# EAGLE design 5940 (EAGLE 7.4.0)
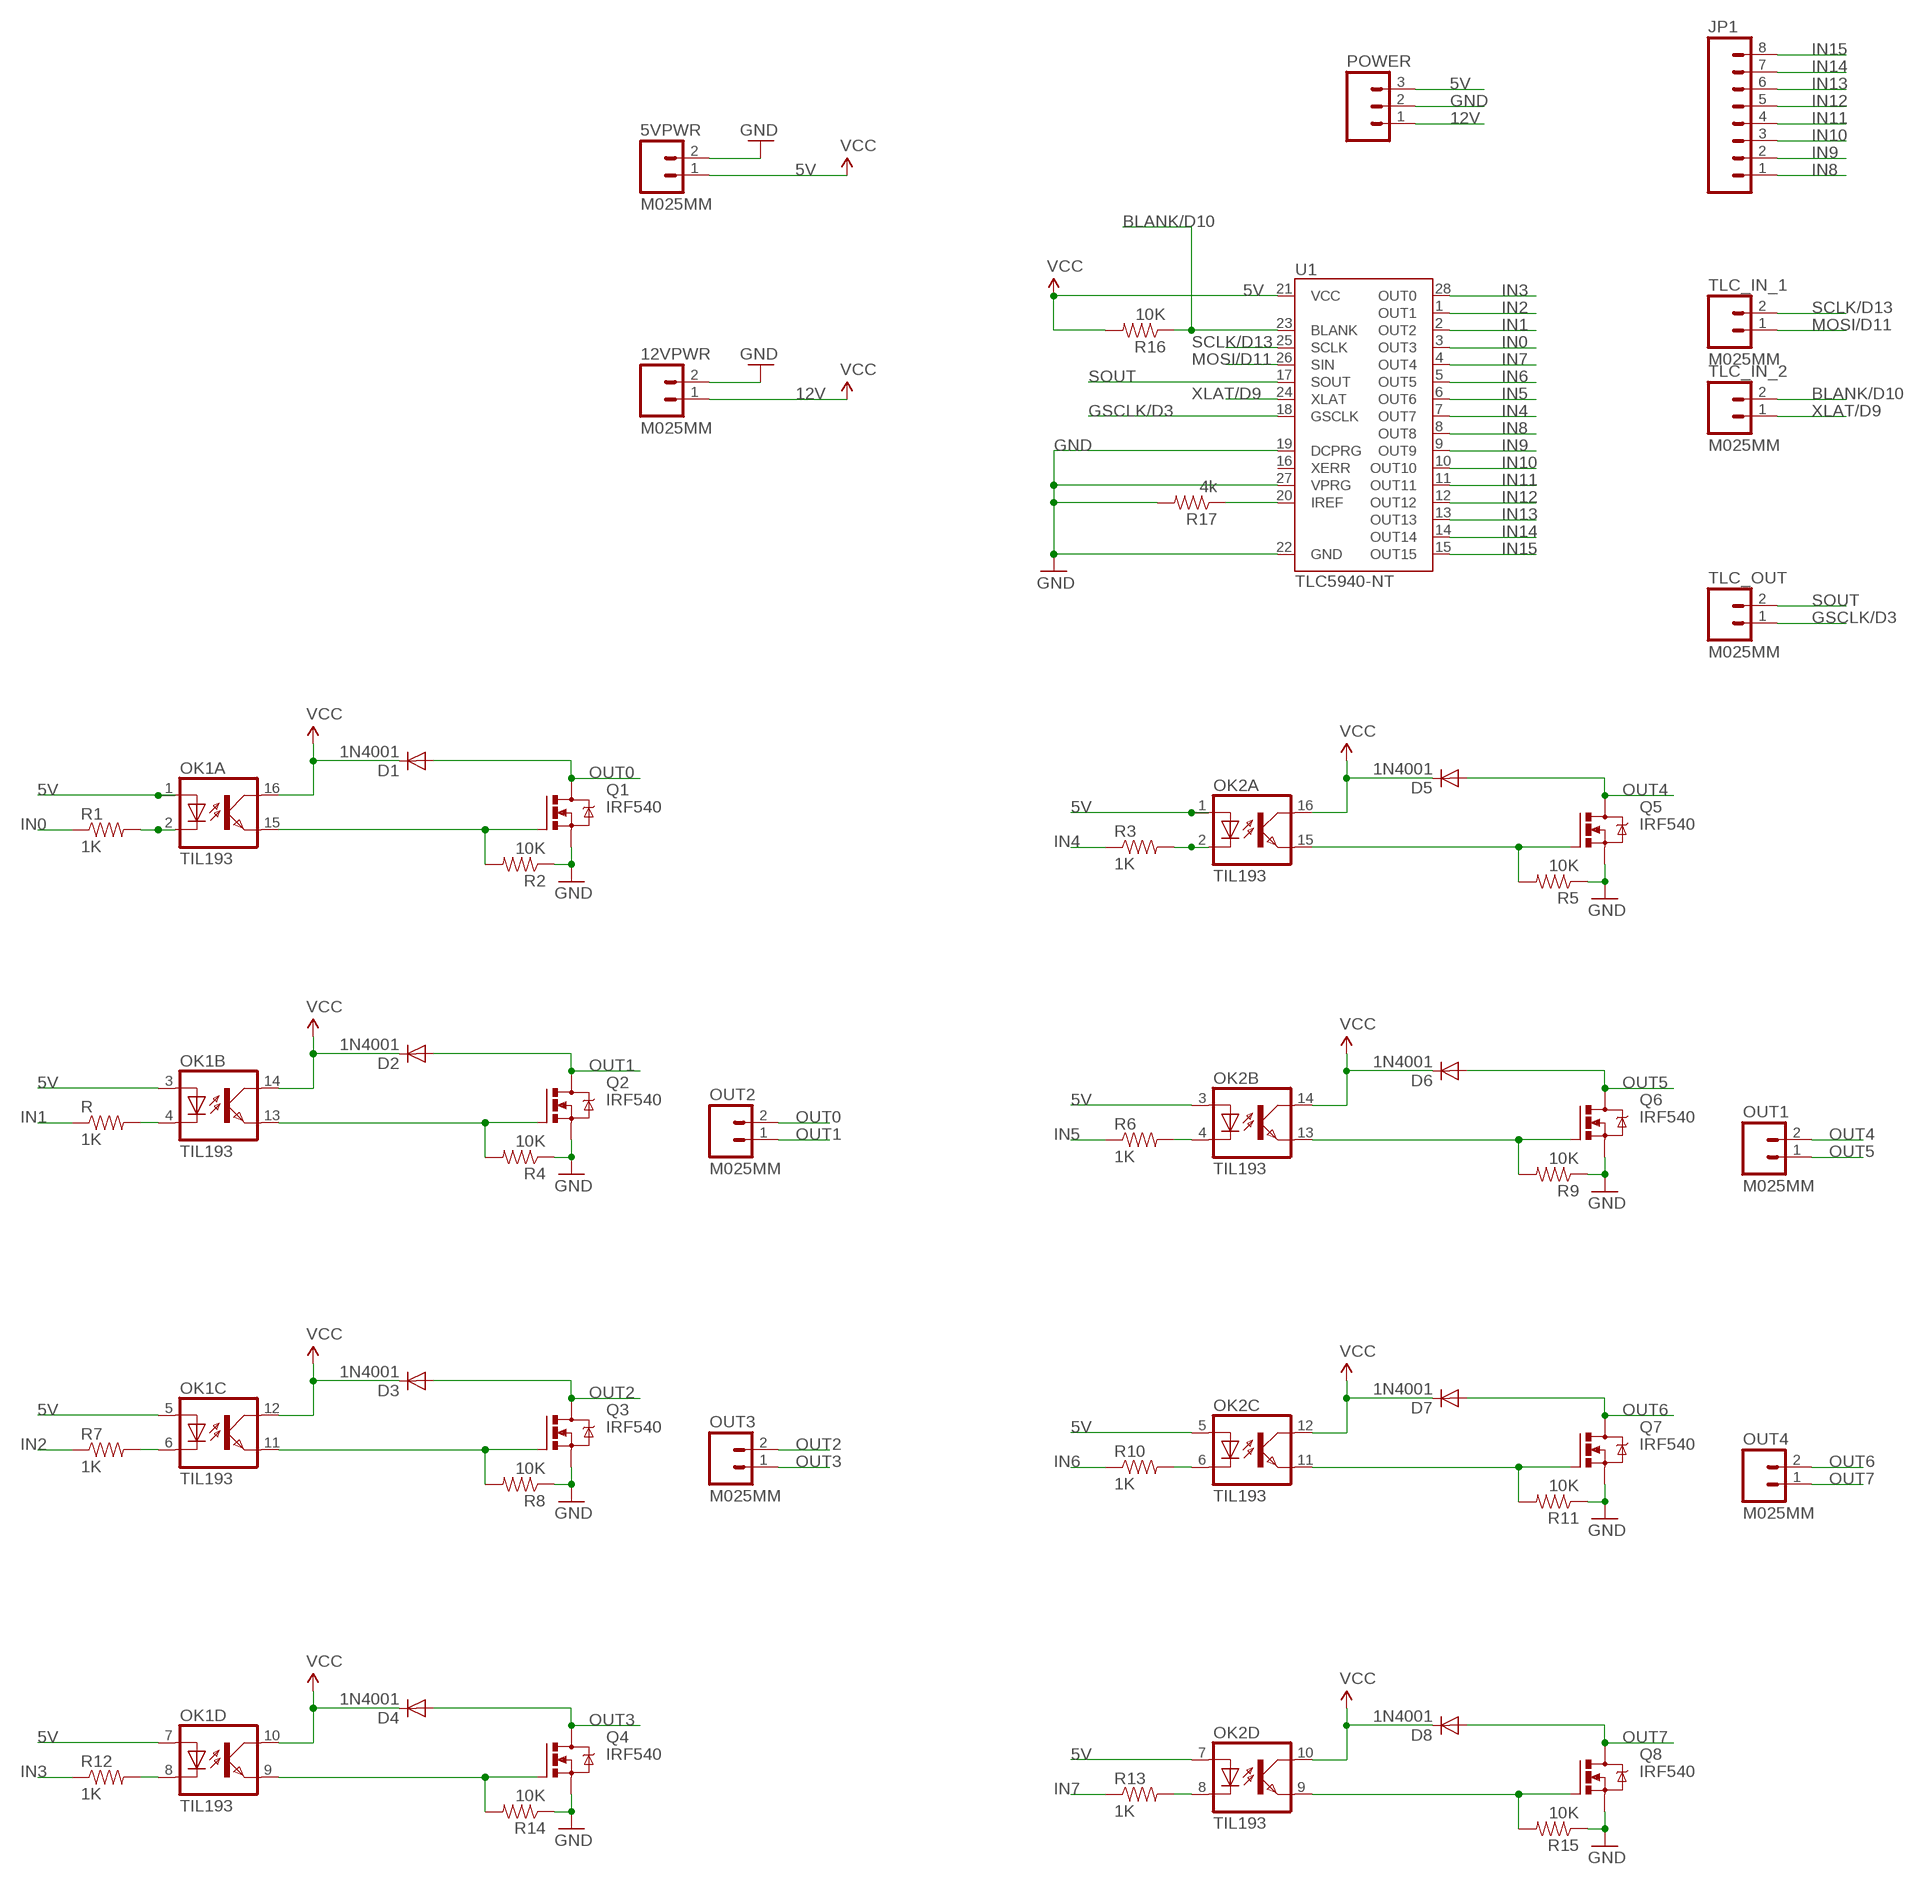
[diagram p0: schematic, sheet 1]

## Parts
5VPWR  M025MM  [SCREWTERMINAL-5MM-2]
12VPWR  M025MM  [SCREWTERMINAL-5MM-2]
D1  1N4001  DIODEPTH  [DIODE-1N4001]
D2  1N4001  DIODEPTH  [DIODE-1N4001]
D3  1N4001  DIODEPTH  [DIODE-1N4001]
D4  1N4001  DIODEPTH  [DIODE-1N4001]
D5  1N4001  DIODEPTH  [DIODE-1N4001]
D6  1N4001  DIODEPTH  [DIODE-1N4001]
D7  1N4001  DIODEPTH  [DIODE-1N4001]
D8  1N4001  DIODEPTH  [DIODE-1N4001]
JP1  M08  [1X08_ROUND]
OK1  TIL193  [DIL16]
OK2  TIL193  [DIL16]
OUT1  M025MM  [SCREWTERMINAL-5MM-2]
OUT2  M025MM  [SCREWTERMINAL-5MM-2]
OUT3  M025MM  [SCREWTERMINAL-5MM-2]
OUT4  M025MM  [SCREWTERMINAL-5MM-2]
POWER  M03LONGPADS  [1X03_LONGPADS]
Q1  IRF540  [TO220BV]
Q2  IRF540  [TO220BV]
Q3  IRF540  [TO220BV]
Q4  IRF540  [TO220BV]
Q5  IRF540  [TO220BV]
Q6  IRF540  [TO220BV]
Q7  IRF540  [TO220BV]
Q8  IRF540  [TO220BV]
R  1K  RESISTORPTH-1/4W  [AXIAL-0.4]
R1  1K  RESISTORPTH-1/4W  [AXIAL-0.4]
R2  10K  RESISTORPTH-1/4W  [AXIAL-0.4]
R3  1K  RESISTORPTH-1/4W  [AXIAL-0.4]
R4  10K  RESISTORPTH-1/4W  [AXIAL-0.4]
R5  10K  RESISTORPTH-1/4W  [AXIAL-0.4]
R6  1K  RESISTORPTH-1/4W  [AXIAL-0.4]
R7  1K  RESISTORPTH-1/4W  [AXIAL-0.4]
R8  10K  RESISTORPTH-1/4W  [AXIAL-0.4]
R9  10K  RESISTORPTH-1/4W  [AXIAL-0.4]
R10  1K  RESISTORPTH-1/4W  [AXIAL-0.4]
R11  10K  RESISTORPTH-1/4W  [AXIAL-0.4]
R12  1K  RESISTORPTH-1/4W  [AXIAL-0.4]
R13  1K  RESISTORPTH-1/4W  [AXIAL-0.4]
R14  10K  RESISTORPTH-1/4W  [AXIAL-0.4]
R15  10K  RESISTORPTH-1/4W  [AXIAL-0.4]
R16  10K  RESISTORPTH-1/4W  [AXIAL-0.4]
R17  4k  RESISTORPTH-1/4W  [AXIAL-0.4]
TLC_IN_1  M025MM  [SCREWTERMINAL-5MM-2]
TLC_IN_2  M025MM  [SCREWTERMINAL-5MM-2]
TLC_OUT  M025MM  [SCREWTERMINAL-5MM-2]
U1  TLC5940-NT  [DIL28-3]

## Nets
5V: 5VPWR.1 OK1.1(A:A) OK1.3(B:A) OK1.5(C:A) OK1.7(D:A) OK2.1(A:A) OK2.3(B:A) OK2.5(C:A) OK2.7(D:A) POWER.3 R16.P$2 U1.21(VCC) ; supply symbol labelled VCC
12V: 12VPWR.1 D1.C D2.C D3.C D4.C D5.C D6.C D7.C D8.C OK1.10(D:COL) OK1.12(C:COL) OK1.14(B:COL) OK1.16(A:COL) OK2.10(D:COL) OK2.12(C:COL) OK2.14(B:COL) OK2.16(A:COL) POWER.1 ; supply symbol labelled VCC
BLANK/D10: R16.P$1 TLC_IN_2.2 U1.23(BLANK)
GND: 5VPWR.2 12VPWR.2 POWER.2 Q1.S Q2.S Q3.S Q4.S Q5.S Q6.S Q7.S Q8.S R2.P$1 R4.P$1 R5.P$1 R8.P$1 R9.P$1 R11.P$1 R14.P$1 R15.P$1 R17.P$2 U1.19(DCPRG) U1.22(GND) U1.27(VPRG)
GSCLK/D3: TLC_OUT.1 U1.18(GSCLK)
IN0: R1.P$1 U1.3(OUT3)
IN1: R.P$1 U1.2(OUT2)
IN2: R7.P$1 U1.1(OUT1)
IN3: R12.P$1 U1.28(OUT0)
IN4: R3.P$1 U1.7(OUT7)
IN5: R6.P$1 U1.6(OUT6)
IN6: R10.P$1 U1.5(OUT5)
IN7: R13.P$1 U1.4(OUT4)
IN8: JP1.1 U1.8(OUT8)
IN9: JP1.2 U1.9(OUT9)
IN10: JP1.3 U1.10(OUT10)
IN11: JP1.4 U1.11(OUT11)
IN12: JP1.5 U1.12(OUT12)
IN13: JP1.6 U1.13(OUT13)
IN14: JP1.7 U1.14(OUT14)
IN15: JP1.8 U1.15(OUT15)
MOSI/D11: TLC_IN_1.1 U1.26(SIN)
N$1: OK2.2(A:C) R3.P$2
N$2: OK1.4(B:C) R.P$2
N$3: OK2.15(A:EMIT) Q5.G R5.P$2
N$4: OK1.15(A:EMIT) Q1.G R2.P$2
N$5: OK1.13(B:EMIT) Q2.G R4.P$2
N$6: OK1.2(A:C) R1.P$2
N$7: OK2.13(B:EMIT) Q6.G R9.P$2
N$8: OK2.4(B:C) R6.P$2
N$9: OK1.11(C:EMIT) Q3.G R8.P$2
N$10: OK2.11(C:EMIT) Q7.G R11.P$2
N$11: OK1.6(C:C) R7.P$2
N$12: OK2.6(C:C) R10.P$2
N$13: OK1.9(D:EMIT) Q4.G R14.P$2
N$14: OK2.9(D:EMIT) Q8.G R15.P$2
N$15: OK1.8(D:C) R12.P$2
N$16: OK2.8(D:C) R13.P$2
N$26: R17.P$1 U1.20(IREF)
OUT0: D1.A OUT2.2 Q1.D
OUT1: D2.A OUT2.1 Q2.D
OUT2: D3.A OUT3.2 Q3.D
OUT3: D4.A OUT3.1 Q4.D
OUT4: D5.A OUT1.2 Q5.D
OUT5: D6.A OUT1.1 Q6.D
OUT6: D7.A OUT4.2 Q7.D
OUT7: D8.A OUT4.1 Q8.D
SCLK/D13: TLC_IN_1.2 U1.25(SCLK)
SOUT: TLC_OUT.2 U1.17(SOUT)
XLAT/D9: TLC_IN_2.1 U1.24(XLAT)
Unconnected: U1.16(XERR)

## Library data of the parts
5VPWR 12VPWR OUT1-OUT4 TLC_IN_1 TLC_IN_2 TLC_OUT = SparkFun-Connectors:M02: Standard 2-pin 0.1" header. Use with - straight break away headers ( PRT-00116) - right angle break away headers (PRT-00553) - swiss pins (PRT-00743) - machine pins (PRT-00117) - female headers (PRT-00115) Molex polarized connector foot print use with: PRT-08233 with associated crimp pins and housings. 2.54_SCREWTERM for use with PRT-10571. 3.5mm Screw Terminal footprints for PRT-08084 5mm Screw Terminal footprints for use with PRT-08433
D1-D8 = SparkFun-DiscreteSemi:DIODE: Diode These are standard reverse protection diodes and small signal diodes. SMA package can handle up to about 1A. SOD-323 can handle about 200mA. What the SOD-323 package when ordering, there are some mfgs out there that are 5-pin packages.
JP1 = SparkFun-Connectors:M08: Header 8 Standard 8-pin 0.1" header. Use with straight break away headers (SKU : PRT-00116), right angle break away headers (PRT-00553), swiss pins (PRT-00743), machine pins (PRT-00117), and female headers (PRT-00115).
OK1 OK2 = optocoupler:TIL193: TEXAS INSTRUMENTS OPTO COUPLER; OC_FARNELL: 1683365; OC_NEWARK: unknown
POWER = SparkFun-Connectors:M03: Header 3 Standard 3-pin 0.1" header. Use with straight break away headers (SKU : PRT-00116), right angle break away headers (PRT-00553), swiss pins (PRT-00743), machine pins (PRT-00117), and female headers (PRT-00115). Molex polarized connector foot print use with SKU : PRT-08232 with associated crimp pins and housings.
Q1-Q8 = transistor-power:IRF540: HEXFET Power MOSFET
R R1-R17 = SparkFun-Resistors:RESISTOR: Resistor Basic schematic elements and footprints for 0603, 1206, and PTH resistors.
U1 = SparkFun-DigitalIC:TLC5940: 16-channel LED Driver with Dot Correction and Grayscale PWM Control The TLC5940 is a 16-channel, constant-current sink LED driver. Each channel has an individually adjustable 4096-step grayscale PWM brightness control and a 64-step, constant-current sink (dot correction). The dot correction adjusts the brightness variations between LED channels and other LED drivers. The dot correction data is stored in an integrated EEPROM. Both grayscale control and dot correction are accessible via a serial interface. A single external resistor sets the maximum current value of all 16 channels. Packages: 28-pin HTSSOP 32-pin 5x5mm QFN 28-pin DIP

## Board
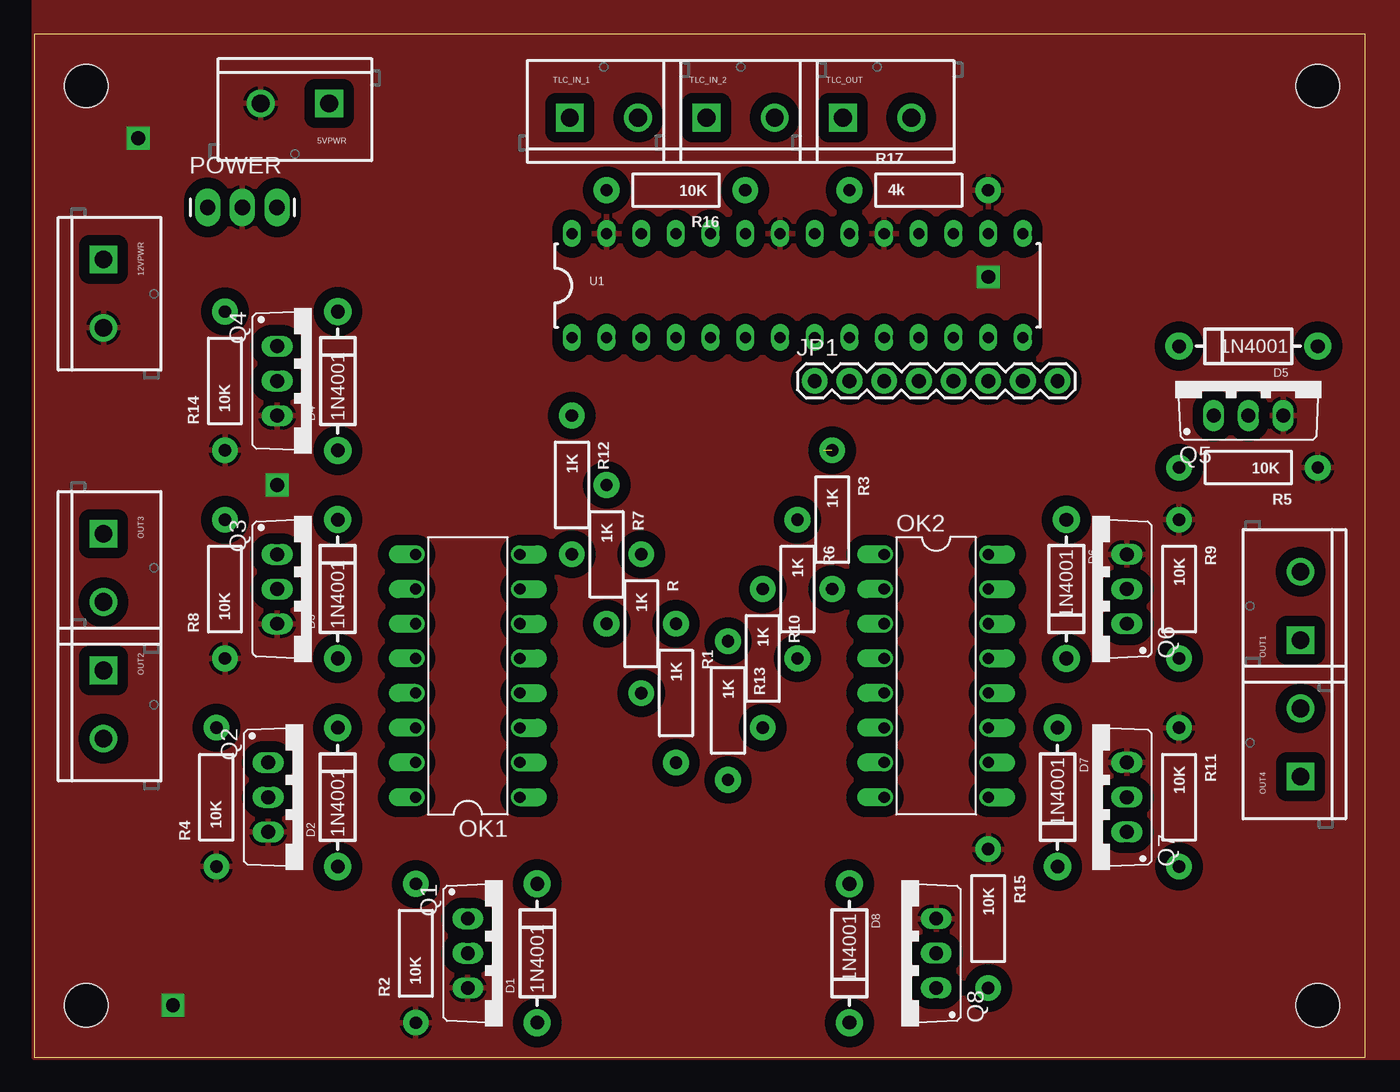
[diagram p1: board, top side]
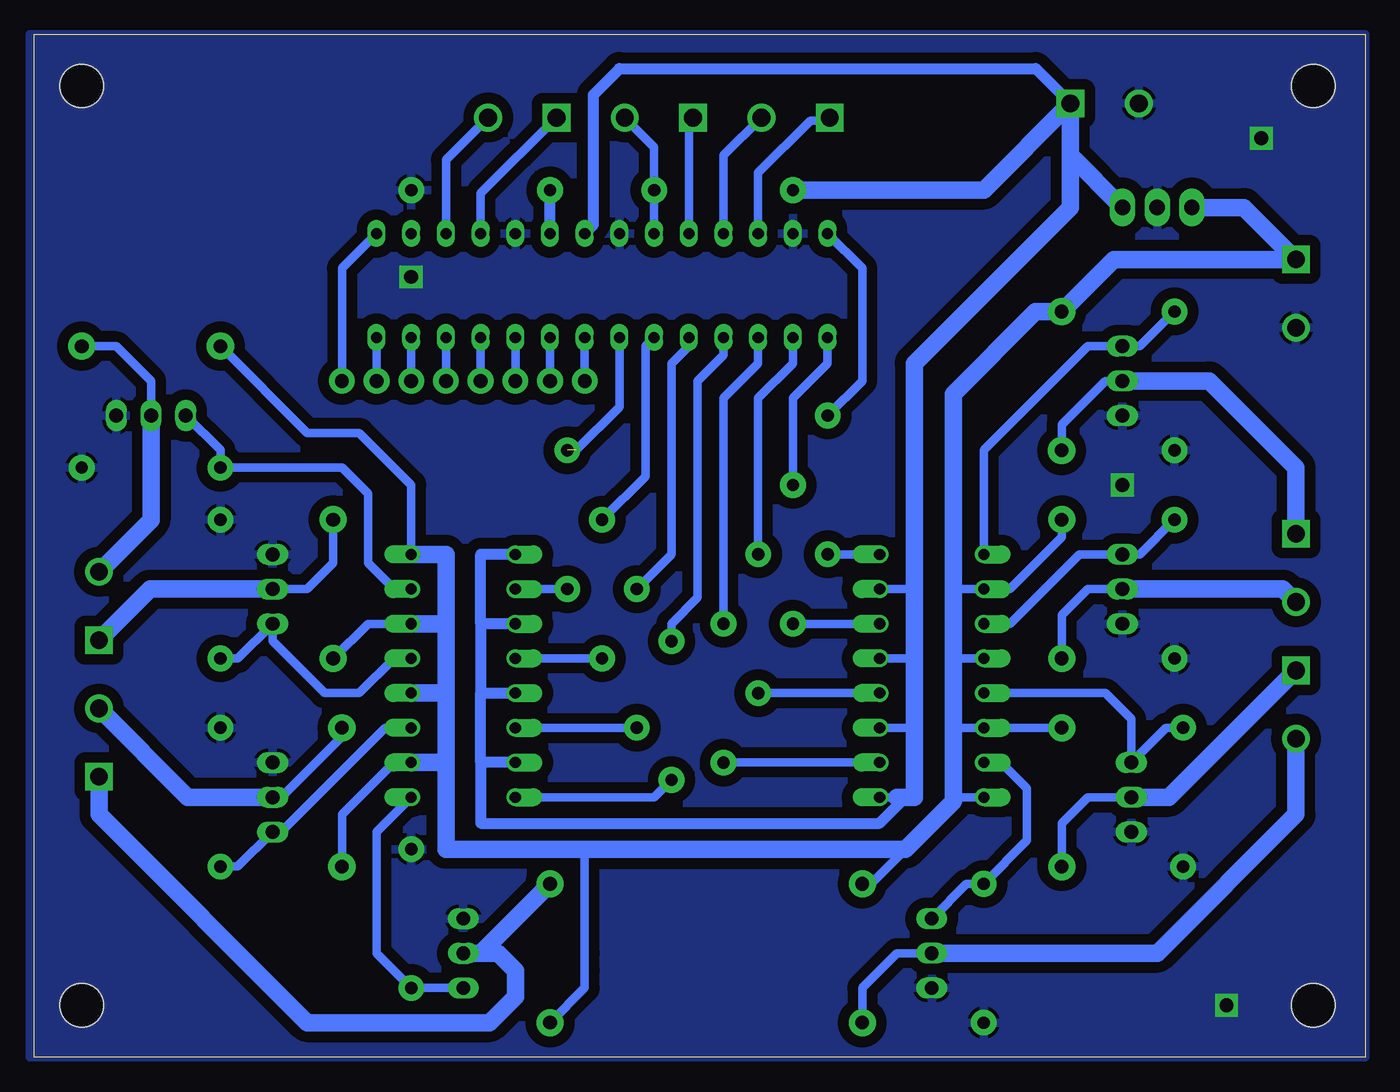
[diagram p2: board, bottom side, seen from below]

Size 97.46 x 74.92 mm. Coordinates in mm from the lower left corner, seen from the top.
Outline: 0,0 97.46,0 97.46,74.92 0,74.92 0,0
Copper layers (1*16): Top 0.035mm / dielectric 1.5mm / Bottom 0.035mm
Design rules "OthermillDRC_1_32_v2": minimum track width 8mil, minimum drill 0.8mm, track to track 0.794003125mm, track to pad 0.794003125mm, pad to pad 0.794003125mm, via to via 0.794003125mm, smd to smd 0mil, copper to edge 0mil, drill to drill 1mil, minimum pad ring 10mil, minimum via ring 10mil, stop-mask expansion 1mil, vias tented up to drill 30mil, thermal gap 10mil
Holes 3.17 mm at 3.81,71.12 3.81,3.81 93.98,3.81 93.98,71.12

### Footprints (pad centres in the part's own frame; a part is rotated, then mirrored left to right if it is on the bottom)
SCREWTERMINAL-5MM-2 = drill 1.3 pad 2.032 square: 1 0,0 | drill 1.3 pad 2.032: 2 5,0
DIODE-1N4001 = drill 1 pad 1.981: A -5.08,0; C 5.08,0
1X08_ROUND = drill 1.016 pad 1.88: 1 0,0; 2 2.54,0; 3 5.08,0; 4 7.62,0; 5 10.16,0; 6 12.7,0; 7 15.24,0; 8 17.78,0
DIL16 = drill 0.813 offset: 1 -8.89,-3.81; 2 -6.35,-3.81; 3 -3.81,-3.81; 4 -1.27,-3.81; 5 1.27,-3.81; 6 3.81,-3.81; 7 6.35,-3.81; 8 8.89,-3.81; 9 8.89,3.81; 10 6.35,3.81; 11 3.81,3.81; 12 1.27,3.81; 13 -1.27,3.81; 14 -3.81,3.81; 15 -6.35,3.81; 16 -8.89,3.81
1X03_LONGPADS = drill 1.118 pad 1.88 long: 1 0,0; 2 2.54,0; 3 5.08,0
TO220BV = drill 1.016 long: D 0,-2.54; G -2.54,-2.54; S 2.54,-2.54
AXIAL-0.4 = drill 0.9 pad 1.88: P$1 -5.08,0; P$2 5.08,0
DIL28-3 = drill 0.813 long: 1 -16.51,-3.81; 2 -13.97,-3.81; 3 -11.43,-3.81; 4 -8.89,-3.81; 5 -6.35,-3.81; 6 -3.81,-3.81; 7 -1.27,-3.81; 8 1.27,-3.81; 9 3.81,-3.81; 10 6.35,-3.81; 11 8.89,-3.81; 12 11.43,-3.81; 13 13.97,-3.81; 14 16.51,-3.81; 15 16.51,3.81; 16 13.97,3.81; 17 11.43,3.81; 18 8.89,3.81; 19 6.35,3.81; 20 3.81,3.81; 21 1.27,3.81; 22 -1.27,3.81; 23 -3.81,3.81; 24 -6.35,3.81; 25 -8.89,3.81; 26 -11.43,3.81; 27 -13.97,3.81; 28 -16.51,3.81

### Placement (x,y rotation side)
5VPWR  21.59,69.85 180 top
12VPWR  5.08,58.42 270 top
D1  36.83,7.62 90 top
D2  22.23,19.05 90 top
D3  22.23,34.29 90 top
D4  22.23,49.52 90 top
D5  88.9,52.07 180 top
D6  75.56,34.29 270 top
D7  74.93,19.05 270 top
D8  59.69,7.62 270 top
JP1  57.15,49.53 0 top
OK1  31.75,27.94 90 top
OK2  66.04,27.94 270 top
OUT1  92.71,30.55 90 top
OUT2  5.08,28.34 270 top
OUT3  5.08,38.34 270 top
OUT4  92.71,20.55 90 top
POWER  12.7,62.23 0 top
Q1  34.29,7.62 270 top
Q2  19.68,19.05 270 top
Q3  20.32,34.29 270 top
Q4  20.32,49.53 270 top
Q5  88.9,49.53 0 top
Q6  77.47,34.29 90 top
Q7  77.47,19.05 90 top
Q8  63.5,7.62 90 top
R  44.45,31.75 270 top
R1  46.99,26.67 270 top
R2  27.94,7.62 90 top
R3  58.42,39.37 270 top
R4  13.34,19.05 90 top
R5  88.9,43.18 180 top
R6  55.88,34.29 270 top
R7  41.91,36.83 270 top
R8  13.97,34.29 90 top
R9  83.82,34.29 270 top
R10  53.34,29.21 270 top
R11  83.82,19.05 270 top
R12  39.37,41.91 270 top
R13  50.8,25.4 270 top
R14  13.97,49.53 90 top
R15  69.85,10.16 270 top
R16  46.99,63.5 180 top
R17  64.77,63.5 0 top
TLC_IN_1  39.22,68.81 0 top
TLC_IN_2  49.22,68.81 0 top
TLC_OUT  59.22,68.81 0 top
U1  55.88,56.52 0 top

### Tracks (layer width: path | path; a pad name or v marks a point on that pad's centre or on a via)
5V
  Bottom 0.61: 33.66,19.05 34.29,19.05 OK1.1 | OK1.7 33.02,34.29 33.02,29.21 OK1.5 | OK1.3 33.02,24.13 33.02,19.05
  Bottom 0.813: 64.77,31.75 64.77,26.67 | 64.77,21.59 64.77,17.14 35.56,17.14 33.66,19.05 | OK2.7 64.77,21.59 | 64.77,21.59 64.77,26.67 | 64.77,26.67 OK2.5 | OK2.3 64.77,31.75 | 64.77,31.75 64.77,36.83 OK2.1 | U1.21 56.52,60.96 56.52,70.48 54.61,72.39 24.13,72.39 5VPWR.1
  Bottom 1.27: 5VPWR.1 21.59,62.23 33.02,50.8 33.02,29.21 33.02,19.05 34.29,19.05 | POWER.3 21.59,66.04 5VPWR.1 | R16.P$2 27.94,63.5 5VPWR.1
12V
  Bottom 0.61: OK1.16 29.84,19.05 30.16,18.73 36.2,12.7 D1.C | D2.C OK1.14 30.16,24.13 | D3.C 22.23,38.1 26.04,34.29 OK1.10 30.16,34.29 30.16,29.21 OK1.12 | 57.15,15.24 57.15,7.62 57.15,6.35 57.15,5.08 D8.C | D7.C 74.93,17.78 71.12,21.59 OK2.10 | D6.C 73.03,31.75 OK2.14 | OK2.16 69.85,41.91 73.66,45.72 77.47,45.72 D5.C
  Bottom 1.27: 68.58,21.59 OK2.10 67.31,21.59 | 67.31,26.67 67.31,21.59 | OK2.12 67.31,26.67 | 67.31,26.67 67.31,31.75 | OK2.14 67.31,31.75 | 67.31,31.75 67.31,36.83 OK2.16 | 67.31,21.59 67.31,15.24 57.15,15.24 33.66,15.24 30.16,18.73 30.16,24.13 30.16,29.21 30.16,48.58 24.14,54.6 D4.C 18.41,58.42 12VPWR.1 8.89,62.23 POWER.1
BLANK/D10
  Bottom 0.61: U1.23 R16.P$1 52.07,66.66 TLC_IN_2.2
GND  (via drill 1.02 pad 1.68)
  other vias: 69.85,57.15 7.62,67.31 17.78,41.91 10.16,3.81
  pour Top: 0,86.36 107.95,86.36 107.95,0 0,0
  pour Bottom: 0,0 0,74.93 97.79,74.93 97.79,0
GSCLK/D3
  Bottom 0.61: U1.18 64.77,63.26 TLC_OUT.1
IN0
  Bottom 0.61: R1.P$1 46.99,48.26 44.45,50.8 U1.3
IN1
  Bottom 0.61: R.P$1 44.45,48.26 41.91,50.8 U1.2
IN2
  Bottom 0.61: R7.P$1 41.91,48.26 39.37,50.8 U1.1
IN3
  Bottom 0.61: R12.P$1 36.83,49.53 36.83,57.78 U1.28
IN4  (1 unrouted)
  Bottom 0.61: 57.78,44.45 54.61,47.62 U1.7
IN5
  Bottom 0.61: R6.P$1 52.7,42.55 52.7,52.07 U1.6
IN6
  Bottom 0.61: R10.P$1 50.8,36.83 50.8,50.8 49.53,52.07 U1.5
IN7
  Bottom 0.61: U1.4 46.99,51.44 48.9,49.53 48.9,33.66 50.8,31.75 R13.P$1
IN8
  Bottom 0.61: JP1.1 U1.8
IN9
  Bottom 0.61: U1.9 JP1.2
IN10
  Bottom 0.61: JP1.3 U1.10
IN11
  Bottom 0.61: U1.11 JP1.4
IN12
  Bottom 0.61: JP1.5 U1.12
IN13
  Bottom 0.61: U1.13 JP1.6
IN14
  Bottom 0.61: JP1.7 U1.14
IN15
  Bottom 0.61: U1.15 74.93,57.78 JP1.8
MOSI/D11
  Bottom 0.61: U1.26 44.45,64.77 40.64,68.58 39.45,68.58 TLC_IN_1.1
N$1
  Bottom 0.61: R3.P$2 OK2.2
N$2
  Bottom 0.61: R.P$2 OK1.4
N$3
  Bottom 0.61: OK2.15 71.12,34.29 73.03,36.2 73.03,41.27 74.93,43.18 R5.P$2 83.82,44.45 Q5.G
N$4
  Bottom 0.61: Q1.G 29.21,12.7 R2.P$2 24.77,15.88 24.77,19.68 26.67,21.59 OK1.15
N$5
  Bottom 0.61: OK1.13 19.05,26.67 17.14,24.77 Q2.G 14.61,24.13 R4.P$2
N$6
  Bottom 0.61: OK1.2 R1.P$2
N$7
  Bottom 0.61: OK2.13 71.12,29.21 73.66,26.67 76.2,26.67 80.01,30.48 Q6.G 82.55,29.21 R9.P$2
N$8
  Bottom 0.61: R6.P$2 OK2.4
N$9
  Bottom 0.61: OK1.11 26.04,31.75 20.95,36.83 Q3.G 16.51,36.83 R8.P$2
N$10
  Bottom 0.61: R11.P$2 82.55,13.97 Q7.G 79.38,16.51 71.75,24.13 OK2.11
N$11
  Bottom 0.61: OK1.6 R7.P$2
N$12
  Bottom 0.61: OK2.6 R10.P$2
N$13
  Bottom 0.61: OK1.9 27.94,44.45 20.32,52.07 Q4.G 16.51,52.07 R14.P$2
N$14
  Bottom 0.61: Q8.G R15.P$2 72.39,7.62 72.39,16.51 OK2.9
N$15
  Bottom 0.61: R12.P$2 OK1.8
N$16
  Bottom 0.61: R13.P$2 52.07,19.05 OK2.8
N$26
  Bottom 0.813: U1.20 R17.P$1
OUT0
  Bottom 0.61: Q1.D 34.29,7.62 36.83,5.08 D1.A
  Bottom 1.27: Q1.D 15.24,7.62 5.08,17.78 OUT2.2
OUT1
  Bottom 0.61: D2.A 22.23,17.14 20.32,19.05 Q2.D
  Bottom 1.27: Q2.D 14.37,19.05 OUT2.1
OUT2
  Bottom 0.61: D3.A 22.23,32.38 20.32,34.29 Q3.D
  Bottom 1.27: Q3.D 6.03,34.29 OUT3.2
OUT3
  Bottom 0.61: D4.A 22.23,46.34 19.05,49.53 Q4.D
  Bottom 1.27: Q4.D 11.43,49.53 5.08,43.18 OUT3.1
OUT4
  Bottom 0.61: Q5.D 88.9,49.53 91.44,52.07 D5.A
  Bottom 1.27: Q5.D 88.9,39.36 OUT1.2
OUT5
  Bottom 0.61: Q6.D 77.47,34.29 75.56,36.2 D6.A
  Bottom 1.27: OUT1.1 88.97,34.29 Q6.D
OUT6
  Bottom 0.61: Q7.D 79.38,19.05 74.93,23.5 D7.A
  Bottom 1.27: Q7.D 86.21,19.05 OUT4.2
OUT7
  Bottom 1.27: OUT4.1 92.71,17.78 77.47,2.54 64.14,2.54 62.23,4.45 62.23,6.35 63.5,7.62 Q8.D 64.77,7.62 D8.A
SCLK/D13
  Bottom 0.61: U1.25 46.99,66.04 TLC_IN_1.2
SOUT
  Bottom 0.61: TLC_OUT.2 67.31,65.72 U1.17
XLAT/D9
  Bottom 0.61: U1.24 49.53,68.5 TLC_IN_2.1